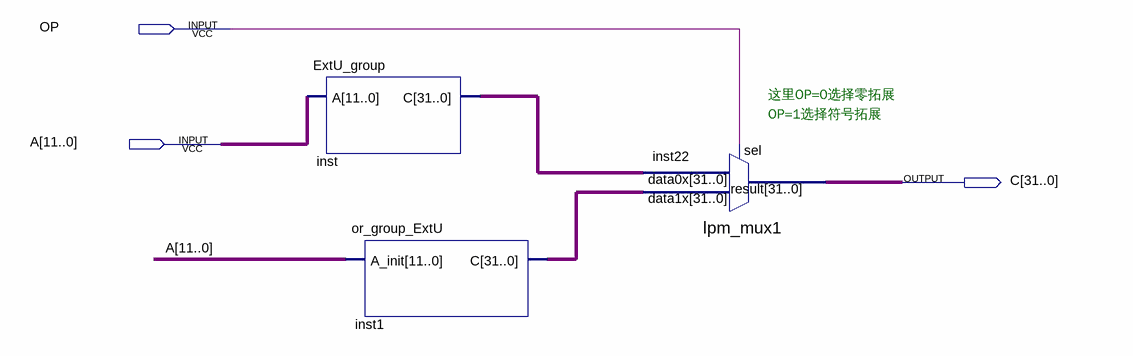
[diagram p0: schematic sheet]
// Quartus schematic ExtU.bdf as structural Verilog: 3 symbols, 3 pins
module ExtU (
  input  OP,
  input  [11:0] A,
  output [31:0] C
);

  wire [31:0] inst1_c, inst_c;

  ExtU_group inst (.A(A), .C(inst_c));
  or_group_ExtU inst1 (.A_init(A), .C(inst1_c));
  lpm_mux1 inst22 (.data1x(inst1_c), .data0x(inst_c), .sel(OP), .result(C));

  // Notes on the sheet:
  //   这里OP=0选择零拓展
  //   OP=1选择符号拓展
endmodule
